# Altium schematic sheet S7CAS-PLEIADES-CARTE-MERE_P07_ETH.SchDoc
size Tabloid; DocumentNumber: 14; SheetNumber: 14; SheetTotal: 16; Sheet_Name: ETH; Size: 11x17
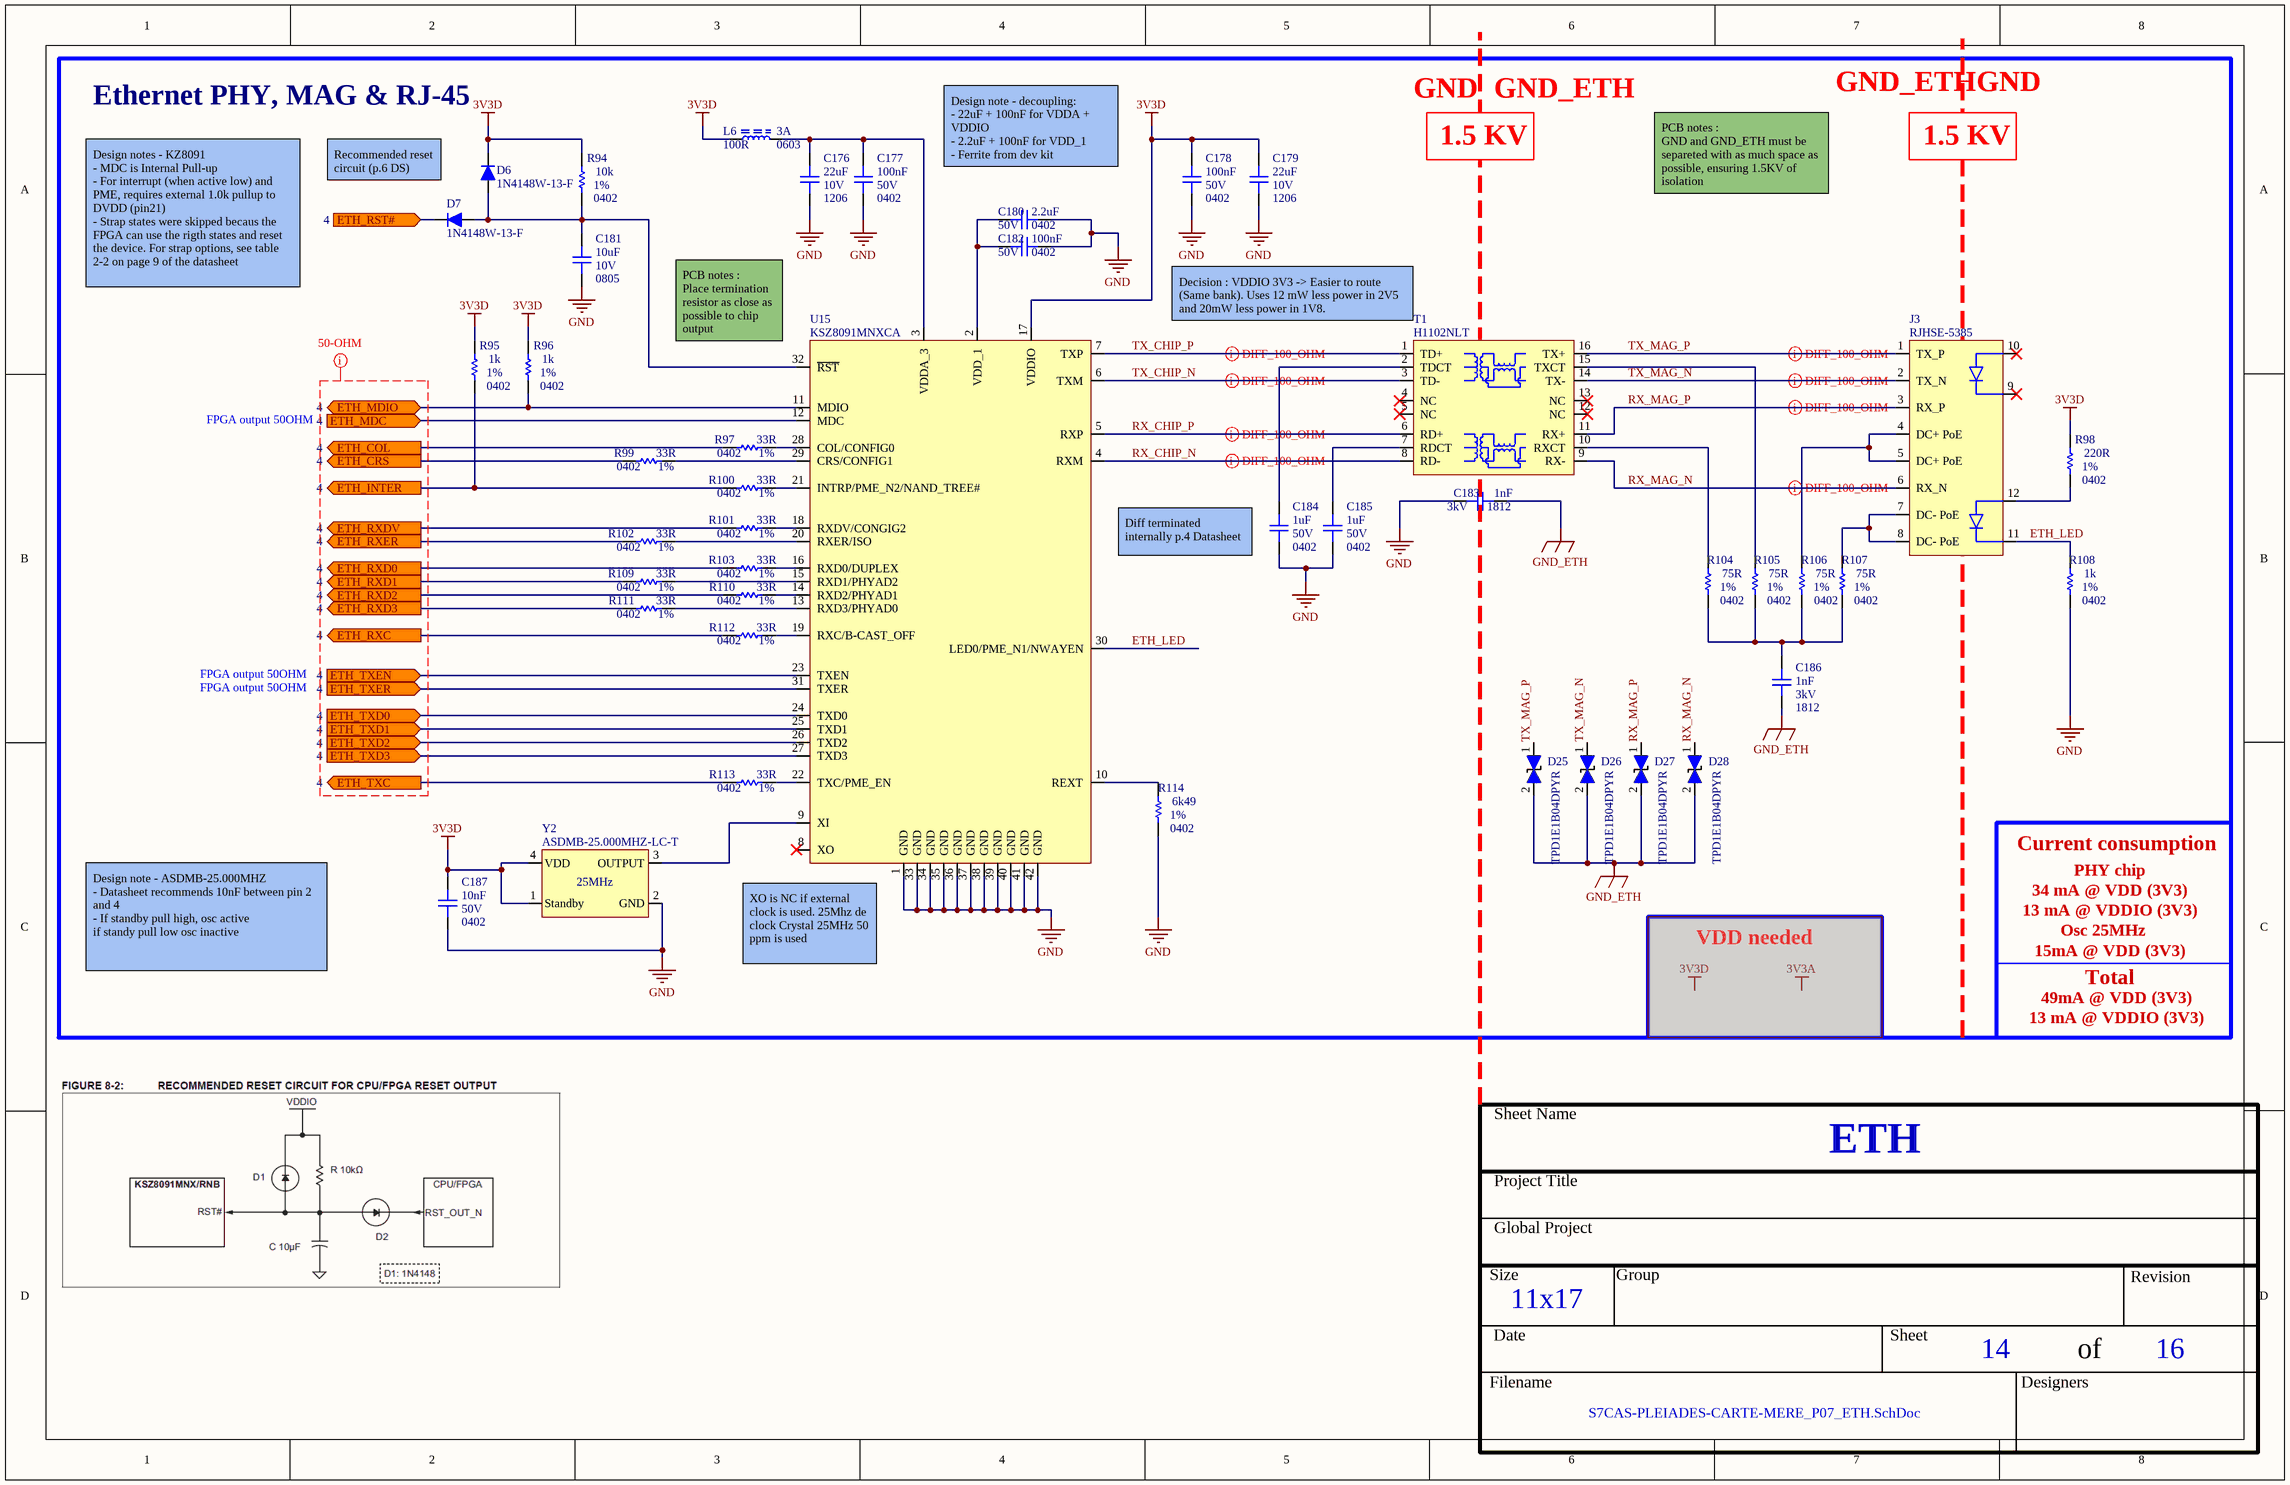
[diagram p0: S7CAS-PLEIADES-CARTE-MERE_P07_ETH.SchDoc]

## Parts
C176  value 22uF  Voltage: 10V  Package: 1206  [CAP_1206]  (hidden comment: CAP - 1206)
C177  value 100nF  Voltage: 50V  Package: 0402  [CAP_0402]  (hidden comment: CAP - 0402)
C178  value 100nF  Voltage: 50V  Package: 0402  [CAP_0402]  (hidden comment: CAP - 0402)
C179  value 22uF  Voltage: 10V  Package: 1206  [CAP_1206]  (hidden comment: CAP - 1206)
C180  value 2.2uF  Voltage: 50V  Package: 0402  [CAP_0402]  (hidden comment: CAP - 0402)
C181  value 10uF  Voltage: 10V  Package: 0805  [CAP_0805]  (hidden comment: CAP - 0805)
C182  value 100nF  Voltage: 50V  Package: 0402  [CAP_0402]  (hidden comment: CAP - 0402)
C183  value 1nF  Voltage: 3kV  Package: 1812  [CAP_1812]  (hidden comment: CAP - 1812)
C184  value 1uF  Voltage: 50V  Package: 0402  [CAP_0402]  (hidden comment: CAP - 0402)
C185  value 1uF  Voltage: 50V  Package: 0402  [CAP_0402]  (hidden comment: CAP - 0402)
C186  value 1nF  Voltage: 3kV  Package: 1812  [CAP_1812]  (hidden comment: CAP - 1812)
C187  value 10nF  Voltage: 50V  Package: 0402  [CAP_0402]  (hidden comment: CAP - 0402)
D6  1N4148W-13-F  [SOD123_DIO]
D7  1N4148W-13-F  [SOD123_DIO]
D25  TPD1E1B04DPYR  [TVS_DATA_TPD1E1B04DPYR]
D26  TPD1E1B04DPYR  [TVS_DATA_TPD1E1B04DPYR]
D27  TPD1E1B04DPYR  [TVS_DATA_TPD1E1B04DPYR]
D28  TPD1E1B04DPYR  [TVS_DATA_TPD1E1B04DPYR]
J3  RJHSE-5385  [CONN_ETHERNET_RJHSE-5385]
L6  value 100R  Current: 3A  Package: 0603  [FER_0603]  (hidden comment: FER - 0603)
R94  value 10k  Package: 0402  Precision: 1%  [RES_0402]  (hidden comment: RES - 0402)
R95  value 1k  Package: 0402  Precision: 1%  [RES_0402]  (hidden comment: RES - 0402)
R96  value 1k  Package: 0402  Precision: 1%  [RES_0402]  (hidden comment: RES - 0402)
R97  value 33R  Package: 0402  Precision: 1%  [RES_0402]  (hidden comment: RES - 0402)
R98  value 220R  Package: 0402  Precision: 1%  [RES_0402]  (hidden comment: RES - 0402)
R99  value 33R  Package: 0402  Precision: 1%  [RES_0402]  (hidden comment: RES - 0402)
R100  value 33R  Package: 0402  Precision: 1%  [RES_0402]  (hidden comment: RES - 0402)
R101  value 33R  Package: 0402  Precision: 1%  [RES_0402]  (hidden comment: RES - 0402)
R102  value 33R  Package: 0402  Precision: 1%  [RES_0402]  (hidden comment: RES - 0402)
R103  value 33R  Package: 0402  Precision: 1%  [RES_0402]  (hidden comment: RES - 0402)
R104  value 75R  Package: 0402  Precision: 1%  [RES_0402]  (hidden comment: RES - 0402)
R105  value 75R  Package: 0402  Precision: 1%  [RES_0402]  (hidden comment: RES - 0402)
R106  value 75R  Package: 0402  Precision: 1%  [RES_0402]  (hidden comment: RES - 0402)
R107  value 75R  Package: 0402  Precision: 1%  [RES_0402]  (hidden comment: RES - 0402)
R108  value 1k  Package: 0402  Precision: 1%  [RES_0402]  (hidden comment: RES - 0402)
R109  value 33R  Package: 0402  Precision: 1%  [RES_0402]  (hidden comment: RES - 0402)
R110  value 33R  Package: 0402  Precision: 1%  [RES_0402]  (hidden comment: RES - 0402)
R111  value 33R  Package: 0402  Precision: 1%  [RES_0402]  (hidden comment: RES - 0402)
R112  value 33R  Package: 0402  Precision: 1%  [RES_0402]  (hidden comment: RES - 0402)
R113  value 33R  Package: 0402  Precision: 1%  [RES_0402]  (hidden comment: RES - 0402)
R114  value 6k49  Package: 0402  Precision: 1%  [RES_0402]  (hidden comment: RES - 0402)
T1  H1102NLT  [TRANSFO_H1102NLT]
U15  KSZ8091MNXCA  [COM_ETH_PHY_KSZ8091MNXCA]
Y2  ASDMB-25.000MHZ-LC-T  [OSC_ASDMB-25.000MHZ-LC-T]

## Ports
ETH_COL (out, see 4), ETH_CRS (out, see 4), ETH_INTER (out, see 4), ETH_MDC (in, see 4), ETH_MDIO (bidir, see 4), ETH_RST# (in, see 4), ETH_RXC (out, see 4), ETH_RXD0 (out, see 4), ETH_RXD1 (out, see 4), ETH_RXD2 (out, see 4), ETH_RXD3 (out, see 4), ETH_RXDV (out, see 4), ETH_RXER (out, see 4), ETH_TXC (out, see 4), ETH_TXD0 (in, see 4), ETH_TXD1 (in, see 4), ETH_TXD2 (in, see 4), ETH_TXD3 (in, see 4), ETH_TXEN (in, see 4), ETH_TXER (in, see 4)

## Nets
3V3D: C178.2 C179.2 C187.2 D6.1 L6.2 R94.2 R95.2 R96.2 R98.2 U15.17(VDDIO) Y2.1(Standby) Y2.4(VDD)
GND: C176.1 C177.1 C178.1 C179.1 C180.1 C181.1 C182.1 C183.2 C184.1 C185.1 C187.1 R108.1 R114.1 U15.1(GND) U15.33(GND) U15.34(GND) U15.35(GND) U15.36(GND) U15.37(GND) U15.38(GND) U15.39(GND) U15.40(GND) U15.41(GND) U15.42(GND) Y2.2(GND)
GND_ETH: C183.1 C186.2 D25.2(i/o) D26.2(i/o) D27.2(i/o) D28.2(i/o)
ETH_COL: R97.2 ; port ETH_COL
ETH_CRS: R99.2 ; port ETH_CRS
ETH_INTER: R95.1 R100.2 ; port ETH_INTER
ETH_LED: J3.11(LED2_K) R108.2 U15.30(LED0/PME_N1/NWAYEN)
ETH_MDC: U15.12(MDC) ; port ETH_MDC
ETH_MDIO: R96.1 U15.11(MDIO) ; port ETH_MDIO
ETH_RST#: D7.1 ; port ETH_RST#
ETH_RXC: R112.2 ; port ETH_RXC
ETH_RXD0: R103.2 ; port ETH_RXD0
ETH_RXD1: R109.2 ; port ETH_RXD1
ETH_RXD2: R110.2 ; port ETH_RXD2
ETH_RXD3: R111.2 ; port ETH_RXD3
ETH_RXDV: R101.2 ; port ETH_RXDV
ETH_RXER: R102.2 ; port ETH_RXER
ETH_TXC: R113.2 ; port ETH_TXC
ETH_TXD0: U15.24(TXD0) ; port ETH_TXD0
ETH_TXD1: U15.25(TXD1) ; port ETH_TXD1
ETH_TXD2: U15.26(TXD2) ; port ETH_TXD2
ETH_TXD3: U15.27(TXD3) ; port ETH_TXD3
ETH_TXEN: U15.23(TXEN) ; port ETH_TXEN
ETH_TXER: U15.31(TXER) ; port ETH_TXER
RX_CHIP_N: T1.8(RD-) U15.4(RXM)
RX_CHIP_P: T1.6(RD+) U15.5(RXP)
RX_MAG_N: D28.1(i/o) J3.6(RX_N) T1.9(RX-)
RX_MAG_P: D27.1(i/o) J3.3(RX_P) T1.11(RX+)
TX_CHIP_N: T1.3(TD-) U15.6(TXM)
TX_CHIP_P: T1.1(TD+) U15.7(TXP)
TX_MAG_N: D26.1(i/o) J3.2(TX_N) T1.14(TX-)
TX_MAG_P: D25.1(i/o) J3.1(TX_P) T1.16(TX+)
NetC176_2: C176.2 C177.2 L6.1 U15.3(VDDA_3)
NetC180_2: C180.2 C182.2 U15.2(VDD_1)
NetC181_2: C181.2 D6.2 D7.2 R94.1 U15.32(~{RST})
NetC184_2: C184.2 T1.2(TDCT)
NetC185_2: C185.2 T1.7(RDCT)
NetC186_1: C186.1 R104.1 R105.1 R106.1 R107.1
NetJ3_4: J3.4(DC+_PoE) J3.5(DC+_PoE) R106.2
NetJ3_7: J3.7(DC-_PoE) J3.8(DC-_PoE) R107.2
NetJ3_12: J3.12(LED2_A) R98.1
NetR97_1: R97.1 U15.28(COL/CONFIG0)
NetR99_1: R99.1 U15.29(CRS/CONFIG1)
NetR100_1: R100.1 U15.21(INTRP/PME_N2/NAND_TREE#)
NetR101_1: R101.1 U15.18(RXDV/CONGIG2)
NetR102_1: R102.1 U15.20(RXER/ISO)
NetR103_1: R103.1 U15.16(RXD0/DUPLEX)
NetR104_2: R104.2 T1.10(RXCT)
NetR105_2: R105.2 T1.15(TXCT)
NetR109_1: R109.1 U15.15(RXD1/PHYAD2)
NetR110_1: R110.1 U15.14(RXD2/PHYAD1)
NetR111_1: R111.1 U15.13(RXD3/PHYAD0)
NetR112_1: R112.1 U15.19(RXC/B-CAST_OFF)
NetR113_1: R113.1 U15.22(TXC/PME_EN)
NetR114_2: R114.2 U15.10(REXT)
NetU15_9: U15.9(XI) Y2.3(OUTPUT)

Not connected (* = marked no-connect by the designer): J3 9(LED1_K)* 10(LED1_A)*; T1 4(NC)* 5(NC)* 12(NC)* 13(NC)*; U15 8(XO)*

## Layout directives
differential pair; net class DIFF_100_OHM; differential pair class DIFF_100_OHM: RX_CHIP_N, RX_CHIP_P, RX_MAG_N, RX_MAG_P, TX_CHIP_N, TX_CHIP_P, TX_MAG_N, TX_MAG_P
net class SE_50OHM; net class ETH: (no net found under the mark)

## Notes on the sheet
- GND_ETH
- GND
- Ethernet PHY, MAG & RJ-45
- Design note - decoupling:
  - 22uF + 100nF for VDDA + VDDIO
  - 2.2uF + 100nF for VDD_1
  - Ferrite from dev kit
- 1.5 KV
- Recommended reset circuit (p.6 DS)
- PCB notes :
  GND and GND_ETH must be separeted with as much space as possible, ensuring 1.5KV of isolation
- Design notes - KZ8091
  - MDC is Internal Pull-up
  - For interrupt (when active low) and PME, requires external 1.0k pullup to DVDD (pin21)
  - Strap states were skipped becaus the FPGA can use the rigth states and reset the device. For strap options, see table 2-2 on page 9 of the datasheet
- (near U15) PCB notes :
  Place termination resistor as close as possible to chip output
- (near T1) Decision : VDDIO 3V3 -> Easier to route (Same bank). Uses 12 mW less power in 2V5 and 20mW less power in 1V8.
- FPGA output 50OHM
- Diff terminated internally p.4 Datasheet
- Current consumption
- PHY chip
- 34 mA @ VDD (3V3)
- Design note - ASDMB-25.000MHZ
  - Datasheet recommends 10nF between pin 2 and 4
  - If standby pull high, osc active
  if standy pull low osc inactive
- (near U15) XO is NC if external clock is used. 25Mhz de clock Crystal 25MHz 50 ppm is used
- VDD needed
- Osc 25MHz
- 13 mA @ VDDIO (3V3)
- 15mA @ VDD (3V3)
- Total
- 49mA @ VDD (3V3)
- Sheet Name
- Project Title
- Global Project
- Size
- Group
- Revision
- Date
- Sheet
- of
- Filename
- Designers

## Library data of the parts
C176 C179 = CAP - 1206: Precision: 10%; Current: *; CreatedBy: Jonathan Bouchard; Power: *
C177 C178 C180 C182 C184 C185 C187 = CAP - 0402: Precision: 10%; Current: *; CreatedBy: Jonathan Bouchard; Power: *
C181 = CAP - 0805: Mfg: CL21B106KPQNNNE; Precision: 10%; Current: *; CreatedBy: Jonathan Bouchard; Power: *
C183 C186 = CAP - 1812: Mfg Part Number: 1812HC102MAT1A; Precision: 10%; Current: *; CreatedBy: Jonathan Bouchard; Power: *
D6 D7 = DIO_1N4148W-13-F: 1N4148; Vendor: Diodes Inc; Built_By: EMA_UL_Team; SourceLibrary: DiodesInc_2015-05-08; Type: DEV; Manufacturer_Part_Number: 1N4148W-13-F; Copyright: Copyright (C) 2018 Accelerated Designs. All rights reserved; RefDes: RefDes
D25-D28 = TVS_DATA_TPD1E1B04DPYR: TVS - TVS DIODE 3.6V 8.5V - 0402; Manufacturer #1: Texas Instruments; Current Rating: 6.3Apeak; Power Max: 50Wpeak; GRAMS Lib Spec: 2.8; Magnetic Material: Unknown; Polarized: No; Value: *; Tolerance: *; Voltage Rating: 3.6V; HelpURL: http://www.ti.com/lit/ds/symlink/tpd1e1b04.pdf; CreatedBy/Date: Keven Deslandes - 2018/10/19; VerifiedBy: Caroline Paulin - 28 janv 2019; Temperature: -40°C ~ 125°C (TA); Package: 0402; Manufacturer #2: *; Note: *; Assembly Type: SMD; Part Number #2: *; Part Number #1: TPD1E1B04DPYR; Supplier 1: Digi-Key; Supplier Part Number 1: 296-47364-1-ND; Cryo: UNKNOWN
J3 = CONN_ETHERNET_RJHSE-5385: CONN - MOD JACK RJ45 R/A ETHERNET - TH; Mfg: Amphenol; Voltage: *; Current: *; Power: *; Mfg Part Number: RJHSE-5385; HelpURL: https://www.amphenolcanada.com/ProductSearch/drawings/AC/RJHSE538X.pdf; CreatedBy: Jonathan Bouchard; Temperature: -55°C ~ 85°C; Value: *; Precision: *; Package: TH-12; Supplier 1: Digikey; Supplier Part Number 1: RJHSE-5385-ND
R94-R114 = RES - 0402: Voltage: 50V; Power: 1/16W; Current: *; CreatedBy: Jonathan Bouchard
T1 = TRANSFO_H1102NLT: TRANSFO - ETHERNET 10/100B-TX - SMD-16; Mfg: Pulse Eng.; Value: 1:1 (350uH); Voltage: *; Current: *; Power: *; Mfg Part Number: H1102NLT; HelpURL: http://media.digikey.com/pdf/Data%20Sheets/Pulse%20PDFs/10_100BASE-T%20Single%20Port%20SMD%20Magnetics_Rev2008.pdf; CreatedBy: Jonathan Bouchard; Temperature: -40°C to 85°C; Precision: *; Package: SMD-16; Supplier 1: Digikey; Supplier Part Number 1: 553-1532-1-ND
U15 = COM_ETH_PHY_KSZ8091MNXCA: COM - ETHERNET PHY 10/100 - QFN-32; Voltage: 1.8V, 2.5V, 3.3V; Mfg: Micrel; Current: *; Power: *; Mfg Part Number: KSZ8091MNXCA; HelpURL: http://ww1.microchip.com/downloads/en/DeviceDoc/00002275A.pdf; CreatedBy: Jonathan Bouchard; Temperature: 0°C ~ 70°C; Value: *; Precision: *; Package: QFN-32; Supplier 1: Digikey; Supplier Part Number 1: 576-4356-ND
Y2 = OSC_ASDMB-25.000MHZ-LC-T: OSC - 25MHz XO (Standard) LVCMOS - 4-SMD, No Lead; Manufacturer #1: Abracon LLC; Tolerance: ±50ppm; Voltage Rating: 1.8V ~ 3.3V; GRAMS Lib Spec: 2.8; Magnetic Material: Unknown; Polarized: Yes; Value: 25MHz; Current Rating: *; Power Max: *; HelpURL: https://abracon.com/Oscillators/ASDMB.pdf; CreatedBy/Date: Joël Lemay 2019-03-29; VerifiedBy: C. Paulin - 29 mai 2019; Temperature: -40°C ~ +85°C; Package: 4-SMD, No Lead; Manufacturer #2: *; Note: *; Assembly Type: SMD; Part Number #2: *; Part Number #1: ASDMB-25.000MHZ-LC-T; Supplier 1: Digi-Key; Supplier Part Number 1: 535-11730-1-ND; Cryo: UNKNOWN
L6 = FER - 0603: Voltage: *; CreatedBy: Jonathan Bouchard; Power: *; Precision: *